# Altium schematic sheet ampli1.SchDoc
size B
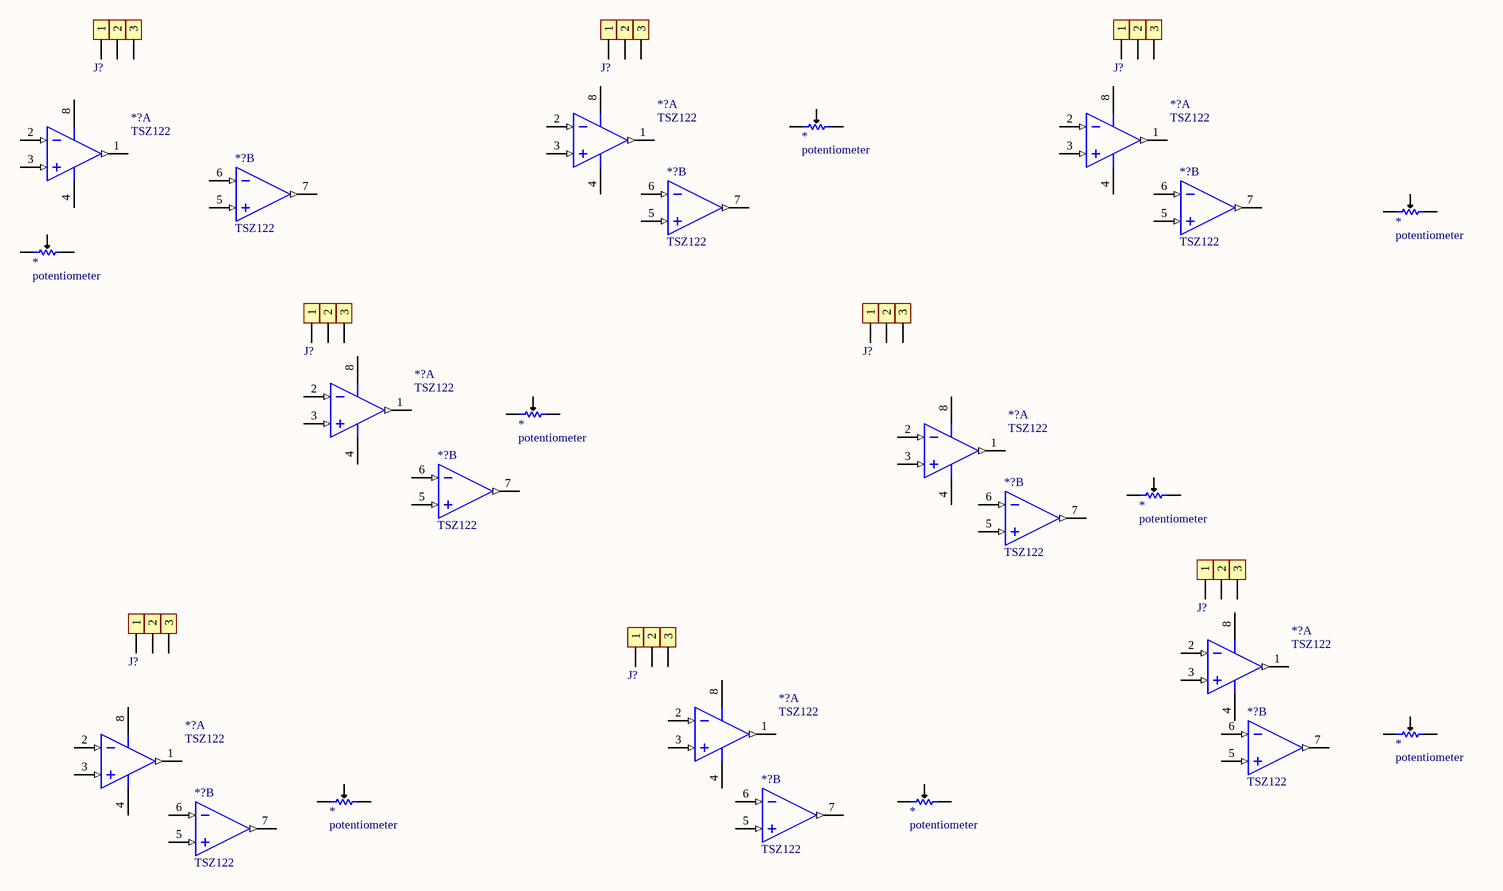
[diagram p0: ampli1.SchDoc]

## Parts
(Parts that share a designator on the sheet are numbered #1, #2 ... from top to bottom, then left to right.)
*#1  potentiometer  [POT_CT6EP500]
*#2  potentiometer  [POT_CT6EP500]
*#3  potentiometer  [POT_CT6EP500]
*#4  potentiometer  [POT_CT6EP500]
*#5  potentiometer  [POT_CT6EP500]
*#6  potentiometer  [POT_CT6EP500]
*#7  potentiometer  [POT_CT6EP500]
*#8  potentiometer  [POT_CT6EP500]
*?#1  TSZ122  [SO8]  (part A of 2)
*?#2  TSZ122  [SO8]  (part A of 2)
*?#3  TSZ122  [SO8]  (part A of 2)
*?#4  TSZ122  [SO8]  (part B of 2)
*?#5  TSZ122  [SO8]  (part B of 2)
*?#6  TSZ122  [SO8]  (part B of 2)
*?#7  TSZ122  [SO8]  (part A of 2)
*?#8  TSZ122  [SO8]  (part A of 2)
*?#9  TSZ122  [SO8]  (part B of 2)
*?#10  TSZ122  [SO8]  (part B of 2)
*?#11  TSZ122  [SO8]  (part A of 2)
*?#12  TSZ122  [SO8]  (part A of 2)
*?#13  TSZ122  [SO8]  (part B of 2)
*?#14  TSZ122  [SO8]  (part A of 2)
*?#15  TSZ122  [SO8]  (part B of 2)
*?#16  TSZ122  [SO8]  (part B of 2)
J?#1  1x3 CONNECTION  (value not drawn)
J?#2  1x3 CONNECTION  (value not drawn)
J?#3  1x3 CONNECTION  (value not drawn)
J?#4  1x3 CONNECTION  (value not drawn)
J?#5  1x3 CONNECTION  (value not drawn)
J?#6  1x3 CONNECTION  (value not drawn)
J?#7  1x3 CONNECTION  (value not drawn)
J?#8  1x3 CONNECTION  (value not drawn)

## Nets

Not connected (* = marked no-connect by the designer): *#1 1 2(1) 3(1); *#2 1 2(1) 3(1); *#3 1 2(1) 3(1); *#4 1 2(1) 3(1); *#5 1 2(1) 3(1); *#6 1 2(1) 3(1); *#7 1 2(1) 3(1); *#8 1 2(1) 3(1); *?#1 1(OUTA) 2(INA-) 3(INA+) 4(V-) 8(V+); *?#2 1(OUTA) 2(INA-) 3(INA+) 4(V-) 8(V+); *?#3 1(OUTA) 2(INA-) 3(INA+) 4(V-) 8(V+); *?#4 5(INA+) 6(INA-) 7(OUTA); *?#5 5(INA+) 6(INA-) 7(OUTA); *?#6 5(INA+) 6(INA-) 7(OUTA); *?#7 1(OUTA) 2(INA-) 3(INA+) 4(V-) 8(V+); *?#8 1(OUTA) 2(INA-) 3(INA+) 4(V-) 8(V+); *?#9 5(INA+) 6(INA-) 7(OUTA); *?#10 5(INA+) 6(INA-) 7(OUTA); *?#11 1(OUTA) 2(INA-) 3(INA+) 4(V-) 8(V+); *?#12 1(OUTA) 2(INA-) 3(INA+) 4(V-) 8(V+); *?#13 5(INA+) 6(INA-) 7(OUTA); *?#14 1(OUTA) 2(INA-) 3(INA+) 4(V-) 8(V+); *?#15 5(INA+) 6(INA-) 7(OUTA); *?#16 5(INA+) 6(INA-) 7(OUTA); J?#1 1 2 3; J?#2 1 2 3; J?#3 1 2 3; J?#4 1 2 3; J?#5 1 2 3; J?#6 1 2 3; J?#7 1 2 3; J?#8 1 2 3

## Library data of the parts
J?#1-J?#8 = 1x3 CONNECTION: 1x3 connection, pitch2.54mm, hole 1mm; pitch: 2.54mm; hole: 1mm